# Altium schematic sheet Portable Power Source.SchDoc
size A4
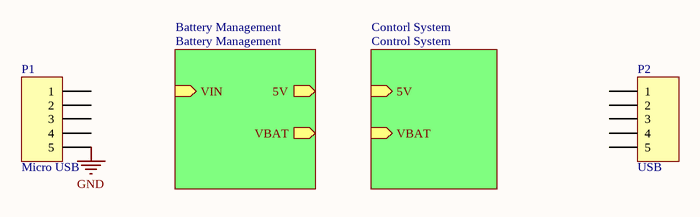
[diagram p0: Portable Power Source.SchDoc]

## Parts
P1  Micro USB  [MHDR1X5]
P2  USB  [MHDR1X5]

## Sub-sheets
Battery Management = Battery Management: VIN (in), 5V (out), VBAT (out)
Contorl System = Control System: 5V (in), VBAT (in)

## Nets
GND: P1.5

Not connected (* = marked no-connect by the designer): P1 1 2 3 4; P2 1 2 3 4 5

## Library data of the parts
P1 P2 = MHDR1X5: Header, 5-Pin; LatestRevisionDate: 17-Jul-2002; LatestRevisionNote: Re-released for DXP Platform.; Publisher: Altium Limited